# EAGLE design ledFire (EAGLE 6.4)
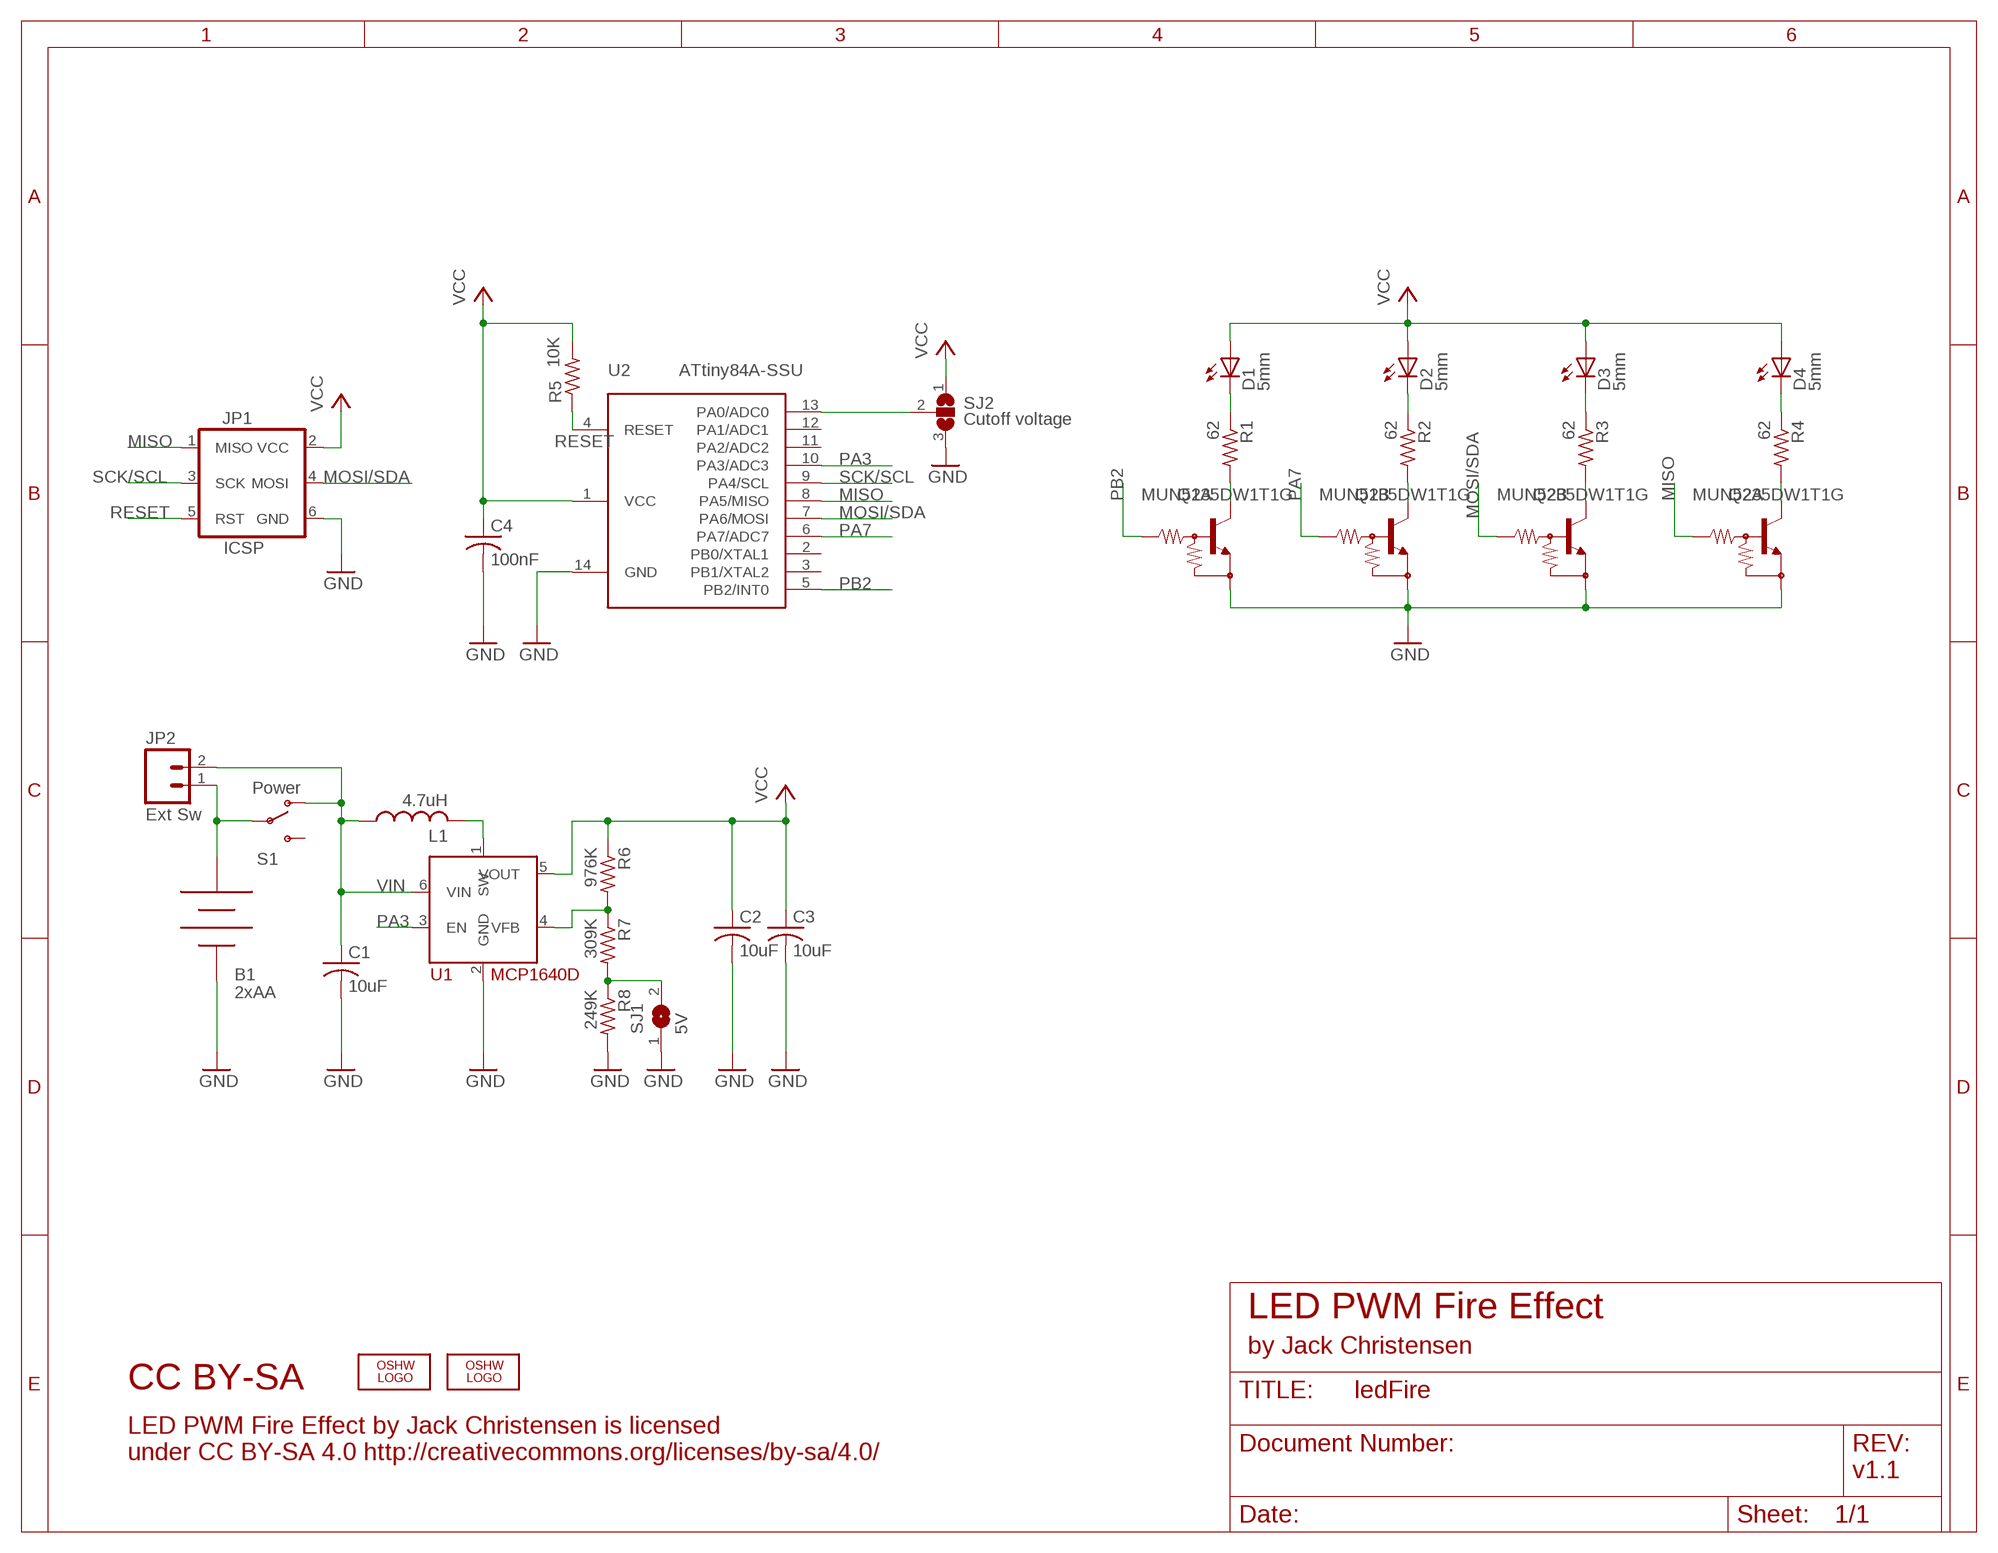
[diagram p0: schematic, sheet 1]

## Parts
B1  2xAA  BATTERY-2AANOHOLES  [KEYSTONE-2462-NO-HOLES]
C1  10uF  C-USM0805  [M0805]
C2  10uF  C-USM0805  [M0805]
C3  10uF  C-USM0805  [M0805]
C4  100nF  C-USM0805  [M0805]
D1  5mm  LED5MM  [LED5MM]
D2  5mm  LED5MM  [LED5MM]
D3  5mm  LED5MM  [LED5MM]
D4  5mm  LED5MM  [LED5MM]
JP1  ICSP  AVR_SPI_PRG_62X3_LOCK  [2X3_LOCK]
JP2  Ext Sw  M02  [1X02_LONGPADS]
L1  4.7uH  INDUCTORNRS5020  [NRS5020]
LOGO1  OSHW_LOGO_8MILX0100-NT  [OSHW_8X100_NOTEXT]
LOGO2  OSHW_LOGO_8MILX0100-NT  [OSHW_8X100_NOTEXT]
Q1  MUN5235DW1T1G  MUN52XXSOT363  [SOT363_PHILIPS]
Q2  MUN5235DW1T1G  MUN52XXSOT363  [SOT363_PHILIPS]
R1  62  R-US_M0805  [M0805]
R2  62  R-US_M0805  [M0805]
R3  62  R-US_M0805  [M0805]
R4  62  R-US_M0805  [M0805]
R5  10K  R-US_M0805  [M0805]
R6  976K  R-US_M0805  [M0805]
R7  309K  R-US_M0805  [M0805]
R8  249K  R-US_M0805  [M0805]
S1  Power  SWITCH-SPSTSMD2  [SWITCH-SPDT-SMD]
SJ1  5V  SJ  [SJ]
SJ2  Cutoff voltage  SJ2W  [SJ_2]
U1  MCP1640D  MCP1640  [SOT23-6]
U2  ATtiny84A-SSU  ATTINYX4SO14  [SO14]

## Nets
GND: B1.NEG C1.2 C2.2 C3.2 C4.2 JP1.6(GND) Q1.1(B:E) Q1.4(A:E) Q2.1(B:E) Q2.4(A:E) R8.2 SJ1.1 SJ2.3 U1.2(GND) U2.14(GND)
MISO: JP1.1(MISO) Q2.5(A:B) U2.8(PA5/MISO)
MOSI/SDA: JP1.4(MOSI) Q2.2(B:B) U2.7(PA6/MOSI)
N$1: D1.K(C) R1.1
N$2: R6.2 R7.1 U1.4(VFB)
N$3: D2.K(C) R2.1
N$4: Q2.6(B:C) R3.2
N$5: Q1.3(A:C) R1.2
N$6: R7.2 R8.1 SJ1.2
N$7: L1.P$2 U1.1(SW)
N$8: Q1.6(B:C) R2.2
N$9: Q2.3(A:C) R4.2
N$10: B1.POS JP2.1 S1.2(P)
N$11: SJ2.2 U2.13(PA0/ADC0)
N$14: D4.K(C) R4.1
N$15: D3.K(C) R3.1
PA3: U1.3(EN) U2.10(PA3/ADC3)
PA7: Q1.2(B:B) U2.6(PA7/ADC7)
PB2: Q1.5(A:B) U2.5(PB2/INT0)
RESET: JP1.5(RST) R5.1 U2.4(RESET)
SCK/SCL: JP1.3(SCK) U2.9(PA4/SCL)
VCC: C2.1 C3.1 C4.1 D1.A D2.A D3.A D4.A JP1.2(VCC) R5.2 R6.1 SJ2.1 U1.5(VOUT) U2.1(VCC)
VIN: C1.1 JP2.2 L1.P$1 S1.1(O) U1.6(VIN)
Unconnected: S1.3(S) U2.2(PB0/XTAL1) U2.3(PB1/XTAL2) U2.11(PA2/ADC2) U2.12(PA1/ADC1)

## Notes on the sheet
- LED PWM Fire Effect
- by Jack Christensen
- CC BY-SA
- LED PWM Fire Effect by Jack Christensen is licensed
  under CC BY-SA 4.0 http://creativecommons.org/licenses/by-sa/4.0/
- v1.1

## Library data of the parts
B1 = _jc:BATTERY-2AA
C1-C4 = _jc:C-US: CAPACITOR, American symbol
D1-D4 = _jc:LED: LED OSRAM: - CHIPLED LG R971, LG N971, LY N971, LG Q971, LY Q971, LO R971, LY R971 LH N974, LH R974 LS Q976, LO Q976, LY Q976 LO Q996 - Hyper CHIPLED LW Q18S LB Q993, LB Q99A, LB R99A - SideLED LS A670, LO A670, LY A670, LG A670, LP A670 LB A673, LV A673, LT A673, LW A673 LH A674 LY A675 LS A676, LA A676, LO A676, LY A676, LW A676 LS A679, LY A679, LG A679 - Hyper Micro SIDELED® LS Y876, LA Y876, LO Y876, LY Y876 LT Y87S - SmartLED LW L88C, LW L88S LB L89C, LB L89S, LG L890 LS L89K, LO L89K, LY L89K LS L896, LA L896, LO L896, LY L896 - TOPLED LS T670, LO T670, LY T670, LG T670, LP T670 LSG T670, LSP T670, LSY T670, LOP T670, LYG T670 LG T671, LOG T671, LSG T671 LB T673, LV T673, LT T673, LW T673 LH T674 LS T676, LA T676, LO T676, LY T676, LB T676, LH T676, LSB T676, LW T676 LB T67C, LV T67C, LT T67C, LS T67K, LO T67K, LY T67K, LW E67C LS E67B, LA E67B, LO E67B, LY E67B, LB E67C, LV E67C, LT E67C LW T67C LS T679, LY T679, LG T679 LS T770, LO T770, LY T770, LG T770, LP T770 LB T773, LV T773, LT T773, LW T773 LH T774 LS E675, LA E675, LY E675, LS T675 LS T776, LA T776, LO T776, LY T776, LB T776 LHGB T686 LT T68C, LB T68C - Hyper Mini TOPLED® LB M676 - Mini TOPLED Santana® LG M470 LS M47K, LO M47K, LY M47K Source: http://www.osram.convergy.de/
JP1 = _jc:AVR_SPI_PRG_6: AVR ISP 6 Pin This is the reduced ISP connector for AVR programming. Common on Arduino. This footprint will take up less PCB space and can be used with a 10-pin to 6-pin adapter such as SKU: BOB-08508
JP2 = SparkFun:M02: Header 2 Standard 2-pin 0.1" header. Use with straight break away headers (SKU : PRT-00116), right angle break away headers (PRT-00553), swiss pins (PRT-00743), machine pins (PRT-00117), and female headers (PRT-00115). Molex polarized connector foot print use with SKU : PRT-08233 with associated crimp pins and housings.
L1 = _jc:INDUCTOR: Murata #11R472C
LOGO1 LOGO2 = ohw-logo:OSHW_LOGO_8MIL
Q1 Q2 = _jc:MUN52XX
R1-R8 = _jc:R-US_: RESISTOR, American symbol
S1 = SparkFun:SWITCH-SPST: SPST Switch Simple slide switch. Spark Fun Electronics SKU : COM-00102
SJ1 = jumper:SJ: SMD solder JUMPER
SJ2 = jumper:SJ2W: SMD solder JUMPER
U1 = _jc:MCP1640
U2 = _jc:ATTINYX4

## Board
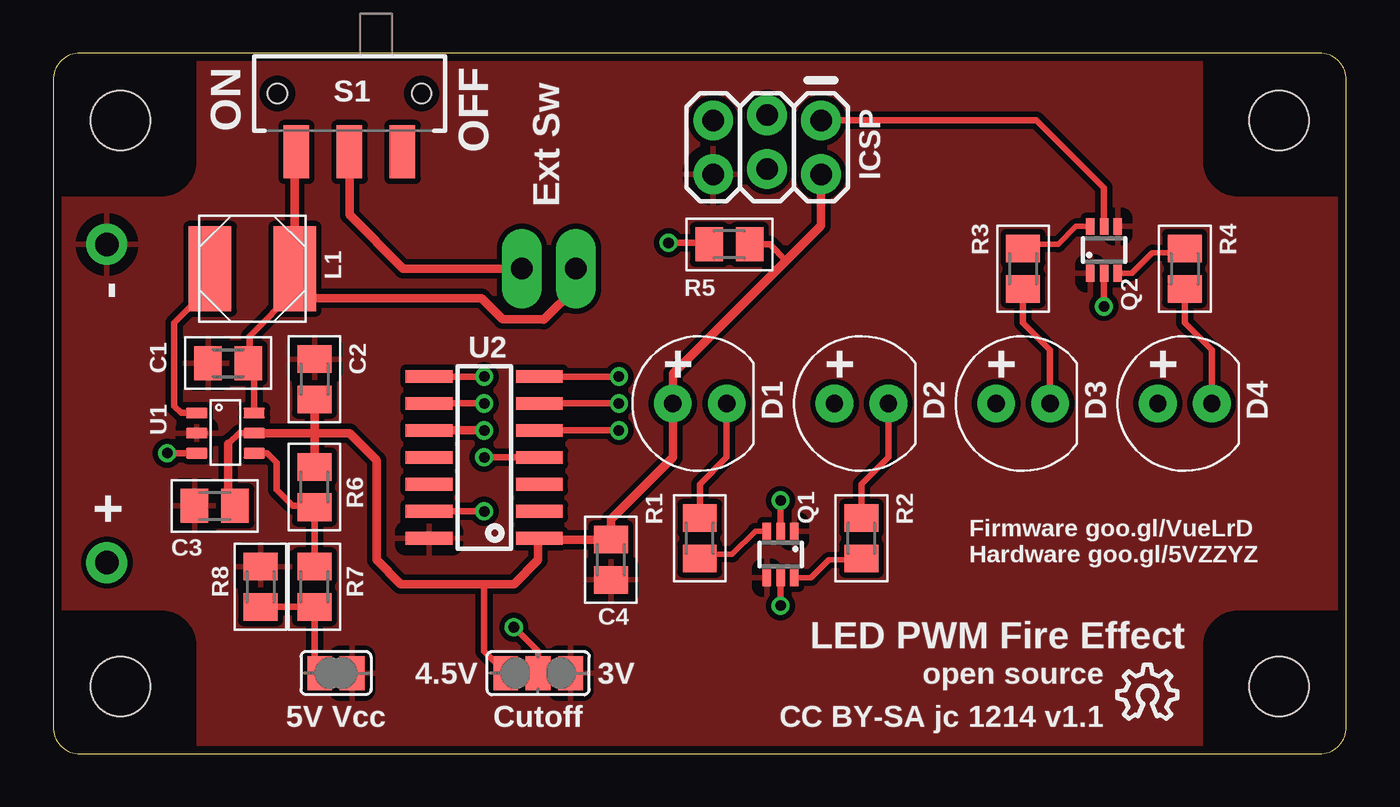
[diagram p1: board, top side]
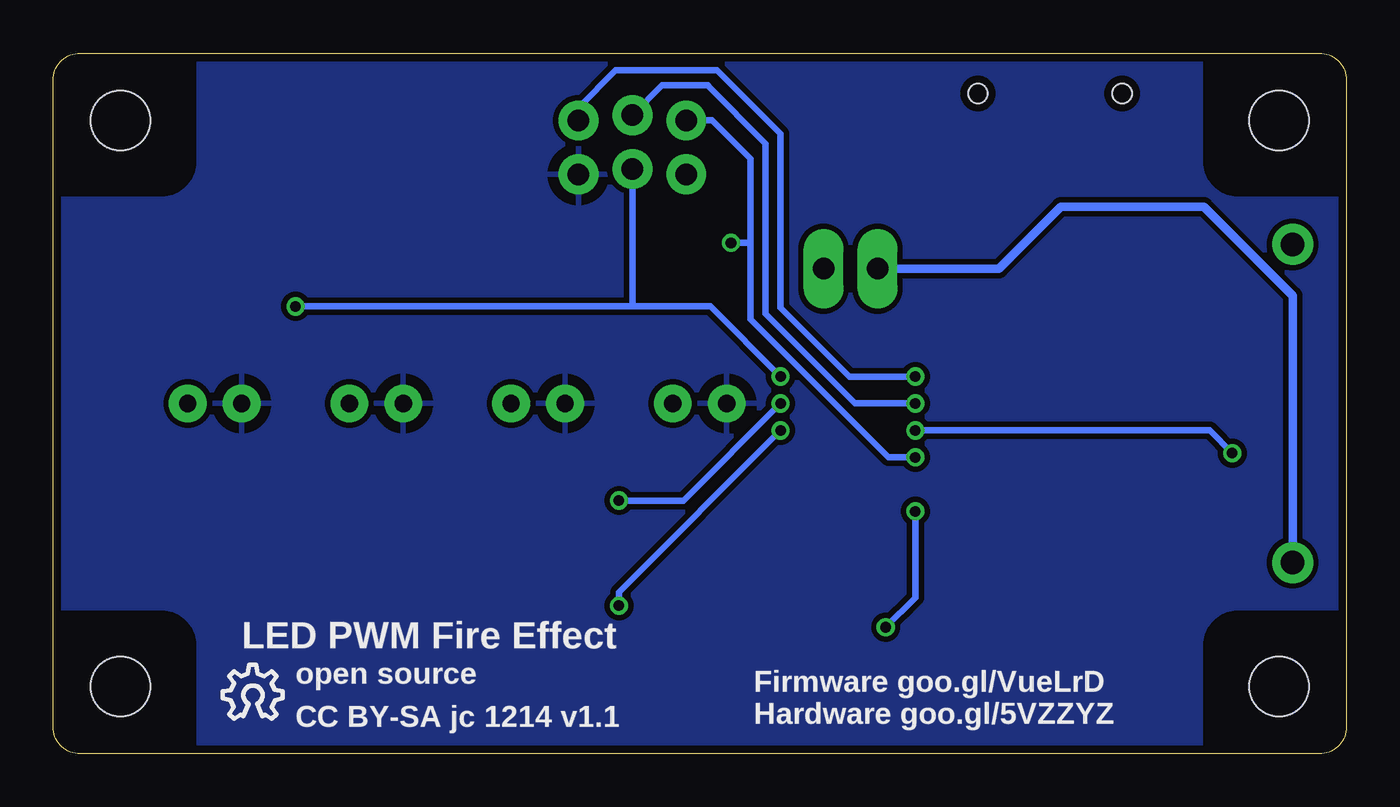
[diagram p2: board, bottom side, seen from below]

Size 60.96 x 33.02 mm. Coordinates in mm from the lower left corner, seen from the top.
Outline: 59.69,33.02 1.27,33.02 arc90 0,31.75 0,1.27 arc90 1.27,0 59.69,0 arc90 60.96,1.27 60.96,31.75 arc90 59.69,33.02
Copper layers (1*16): Top 0.0356mm / dielectric 1.5011mm / Bottom 0.0356mm
Design rules "LaenPCBOrder_jc1 *": minimum track width 10mil, minimum drill 13mil, track to track 8mil, track to pad 8mil, pad to pad 8mil, via to via 8mil, smd to smd 6mil, copper to edge 15mil, drill to drill 6mil, minimum pad ring 7mil, minimum via ring 7mil, stop-mask expansion 4mil, vias tented up to drill 21mil, thermal gap 20mil
Holes 2.8 mm at 57.78,29.84 57.78,3.17 3.17,29.84 3.17,3.17
tRestrict: area 0,26.7 to 6.3,33; area 54.6,26.7 to 61,33; area 0,0 to 6.3,6.3; area 54.6,0 to 61,6.3
bRestrict: area 0,26.7 to 6.3,33; area 54.6,26.7 to 61,33; area 54.6,0 to 61,6.3; area 0,0 to 6.3,6.3

### Footprints (pad centres in the part's own frame; a part is rotated, then mirrored left to right if it is on the bottom)
KEYSTONE-2462-NO-HOLES = drill 1.1 pad 1.93: NEG -27.94,-7.493; POS -27.94,7.493
M0805 = smd 1.3 x 1.6: 1 -0.95,0; 2 0.95,0
LED5MM = drill 0.813 pad 1.778: A -1.27,0; K 1.27,0
2X3_LOCK = drill 1.016 pad 1.88: 1 0,0; 2 0,2.54; 3 2.54,-0.254; 4 2.54,2.286; 5 5.08,0; 6 5.08,2.54
1X02_LONGPADS = drill 1.016 pad 1.88 long: 1 0,0; 2 2.54,0
NRS5020 = smd 2 x 4: P$1 -2,0; P$2 2,0
SOT363_PHILIPS = smd 0.4 x 0.8: 1 -0.65,-1.1; 2 0,-1.1; 3 0.65,-1.1; 4 0.65,1.1; 5 0,1.1; 6 -0.65,1.1
SWITCH-SPDT-SMD = smd 1.2 x 2.5: 1 -2.5,-2.75; 2 0,-2.75; 3 2.5,-2.75 | hole 0.9: -3.4,0; 3.4,0
SJ = smd 1.168 x 1.6: 1 -0.762,0; 2 0.762,0
SJ_2 = smd 1.168 x 1.6: 1 -1.524,0; 2 0,0; 3 1.524,0
SOT23-6 = smd 0.508 x 1.016: 1 -0.95,-1.35; 2 0,-1.35; 3 0.95,-1.35; 4 0.95,1.35; 5 0,1.35; 6 -0.95,1.35
SO14 = smd 0.6 x 2.2: 1 -3.81,-2.6; 2 -2.54,-2.6; 3 -1.27,-2.6; 4 0,-2.6; 5 1.27,-2.6; 6 2.54,-2.6; 7 3.81,-2.6; 8 3.81,2.6; 9 2.54,2.6; 10 1.27,2.6; 11 0,2.6; 12 -1.27,2.6; 13 -2.54,2.6; 14 -3.81,2.6

### Placement (x,y rotation side)
B1  30.48,16.51 180 bottom
C1  8.26,18.41 180 top
C2  12.32,17.65 90 top
C3  7.62,11.68 180 top
C4  26.29,9.14 270 top
D1  30.48,16.51 0 top
D2  38.1,16.51 0 top
D3  45.72,16.51 0 top
D4  53.34,16.51 0 top
JP1  36.2,29.84 180 top
JP2  22.1,22.86 0 top
L1  9.4,22.86 180 top
LOGO1  50.16,1.65 0 top
LOGO2  52.96,1.65 0 bottom
Q1  34.29,9.4 180 top
Q2  49.53,23.75 0 top
R1  30.48,10.16 270 top
R2  38.1,10.16 270 top
R3  45.72,22.86 90 top
R4  53.34,22.86 90 top
R5  31.88,24 0 top
R6  12.32,12.57 270 top
R7  12.32,7.87 270 top
R8  9.78,7.87 90 top
S1  13.97,31.11 0 top
SJ1  13.34,3.81 180 top
SJ2  22.86,3.81 0 top
U1  8.13,15.11 270 top
U2  20.32,13.97 90 top

### Tracks (layer width: path | path; a pad name or v marks a point on that pad's centre or on a via)
GND
  pour Top (isolate 0.254): -2.54,35.56 63.5,35.56 63.5,-2.54 -2.54,-2.54
MISO  (via drill 0.5)
  Top 0.305: U2.8 v20.32,17.78 | JP1.1 46.35,29.84 49.53,26.67 Q2.5
  Bottom 0.305: 36.2,30.1 JP1.1 36.2,30.45 34.44,32.21 29.67,32.21 26.67,29.21 26.67,21.03 23.42,17.78 v20.32,17.78
MOSI/SDA  (via drill 0.5)
  Top 0.305: v26.67,17.78 U2.7 | Q2.2 v49.53,21.08
  Bottom 0.305: v26.67,17.78 29.97,21.08 33.66,21.08 | 33.66,21.08 v49.53,21.08 | JP1.4 33.66,21.08
N$1
  Top 0.305: R1.1 30.48,12.7 31.75,13.97 D1.K
N$2
  Top 0.305: U1.4 10.09,14.16 10.54,13.72 10.54,12.45 11.3,11.68 12.26,11.68 R6.2 R7.1
N$3
  Top 0.305: R2.1 38.1,12.7 39.37,13.97 D2.K
N$4
  Top 0.254: Q2.6 48.22,24.85 47.37,24 45.91,24 R3.2
N$5
  Top 0.254: Q1.3 33.1,10.5 32,9.4 30.67,9.4 R1.2
N$6
  Top 0.305: R8.1 R7.2 12.32,4.06 SJ1.2
N$7
  Top 0.305: L1.P$2 7.4,22 5.71,20.32 5.71,16.38 6.04,16.06 U1.1
N$8
  Top 0.254: Q1.6 35.73,8.3 36.58,9.14 38.03,9.14 R2.2
N$9
  Top 0.254: Q2.3 50.84,22.65 51.82,23.62 53.15,23.62 R4.2
N$10
  Top 0.406: JP2.1 16.51,22.86 13.97,25.4 S1.2
  Bottom 0.406: B1.POS 2.54,21.59 6.73,25.78 13.46,25.78 16.38,22.86 JP2.1
N$11  (via drill 0.5)
  Top 0.305: U2.13 v20.32,11.43 | v21.72,5.97 22.86,4.83 SJ2.2 24.13,3.81
  Bottom 0.305: v21.72,5.97 20.32,7.37 v20.32,11.43
N$14
  Top 0.305: R4.1 53.34,20.32 54.61,19.05 D4.K
N$15
  Top 0.305: R3.1 45.72,20.32 46.99,19.05 D3.K
PA3  (via drill 0.5)
  Top 0.305: U1.3 5.39,14.16 v5.38,14.17
  Top 0.406: U2.10 v20.32,15.24
  Bottom 0.305: v20.32,15.24 6.45,15.24 v5.38,14.17
PA7  (via drill 0.5)
  Top 0.305: v26.67,16.51 U2.6 | Q1.2 v34.29,11.94
  Bottom 0.305: v26.67,16.51 31.24,11.94 v34.29,11.94
PB2  (via drill 0.5)
  Top 0.305: U2.5 v26.67,15.24 | v34.29,6.99 Q1.5
  Bottom 0.305: v26.67,15.24 34.29,7.62 v34.29,6.99
RESET  (via drill 0.5)
  Top 0.305: U2.4 v20.32,13.97 | v29.01,24.08 30.85,24.08 R5.1
  Bottom 0.305: v20.32,13.97 21.59,13.97 28.09,20.47 28.09,24.08 28.19,24.08 | 28.19,24.08 v29.01,24.08 | JP1.5 29.9,29.84 28.09,28.04 28.09,24.18 28.19,24.08
SCK/SCL  (via drill 0.5)
  Top 0.305: v20.32,16.51 U2.9
  Bottom 0.305: 30.1,31.5 30.12,31.5 | 30.12,31.5 32.26,31.5 JP1.3 | v20.32,16.51 23.16,16.51 27.38,20.73 27.38,28.75 30.12,31.5
VCC
  Top 0.305: U1.5 8.76,15.11 8.26,14.61 | R5.2 33.78,24 34.54,23.24 | SJ2.1 20.32,4.83 20.32,8
  Top 0.406: U1.5 12.32,15.11 | U2.1 | C2.1 12.32,15.11 | R6.1 12.32,15.11 | 8.26,14.61 8.26,12 C3.1 | 12.32,15.11 13.97,15.11 15.24,13.84 15.24,9.14 16.38,8 20.32,8 21.72,8 22.86,9.14 22.86,10.1 U2.1 | JP1.2 36.2,24.89 34.54,23.24 29.21,17.91 D1.A 29.21,13.97 26.29,11.05 C4.1 22.99,10.09 U2.1
  pour Bottom (isolate 0.254): -1.27,34.29 -1.27,-1.27 62.23,-1.27 62.23,34.29
VIN
  Top 0.305: L1.P$1 11.4,21.81 9.27,19.68 9.27,18.48 C1.1 9.48,18.14 U1.6
  Top 0.406: 11.4,21.81 11.75,21.46 20.19,21.46 21.18,20.47 23.09,20.47 23.11,20.45 24.64,21.97 JP2.2 | S1.1 11.4,28.29 L1.P$1

### Text on the board
tPlace: ON | OFF | ICSP | Ext Sw | - | + | Firmware goo.gl/VueLrD / Hardware goo.gl/5VZZYZ | LED PWM Fire Effect | 4.5V | 3V | open source | 5V Vcc | Cutoff | CC BY-SA jc 1214 v1.1
bPlace: LED PWM Fire Effect | open source | Firmware goo.gl/VueLrD / Hardware goo.gl/5VZZYZ | CC BY-SA jc 1214 v1.1